# Altium schematic sheet Sheet1.SchDoc
size A4
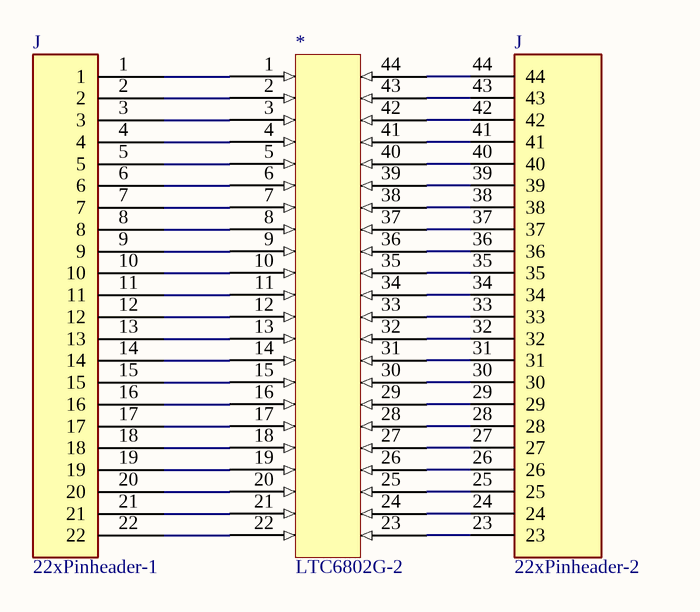
[diagram p0: Sheet1.SchDoc]

## Parts
(Parts that share a designator on the sheet are numbered #1, #2 ... from top to bottom, then left to right.)
*  LTC6802G-2  [LTC6802]
J#1  22xPinheader-1  [22XHEADER1]
J#2  22xPinheader-2  [22xHEADER-2]

## Nets
Net*_1: *.1 J#1.1
Net*_2: *.2 J#1.2
Net*_3: *.3 J#1.3
Net*_4: *.4 J#1.4
Net*_5: *.5 J#1.5
Net*_6: *.6 J#1.6
Net*_7: *.7 J#1.7
Net*_8: *.8 J#1.8
Net*_9: *.9 J#1.9
Net*_10: *.10 J#1.10
Net*_11: *.11 J#1.11
Net*_12: *.12 J#1.12
Net*_13: *.13 J#1.13
Net*_14: *.14 J#1.14
Net*_15: *.15 J#1.15
Net*_16: *.16 J#1.16
Net*_17: *.17 J#1.17
Net*_18: *.18 J#1.18
Net*_19: *.19 J#1.19
Net*_20: *.20 J#1.20
Net*_21: *.21 J#1.21
Net*_22: *.22 J#1.22
Net*_23: *.23 J#2.23
Net*_24: *.24 J#2.24
Net*_25: *.25 J#2.25
Net*_26: *.26 J#2.26
Net*_27: *.27 J#2.27
Net*_28: *.28 J#2.28
Net*_29: *.29 J#2.29
Net*_30: *.30 J#2.30
Net*_31: *.31 J#2.31
Net*_32: *.32 J#2.32
Net*_33: *.33 J#2.33
Net*_34: *.34 J#2.34
Net*_35: *.35 J#2.35
Net*_36: *.36 J#2.36
Net*_37: *.37 J#2.37
Net*_38: *.38 J#2.38
Net*_39: *.39 J#2.39
Net*_40: *.40 J#2.40
Net*_41: *.41 J#2.41
Net*_42: *.42 J#2.42
Net*_43: *.43 J#2.43
Net*_44: *.44 J#2.44

## Library data of the parts
J#1 = 22xPinheader-1: Pin header; pin strips; male; PIN: 50; straight; 2.54mm; THT; 1x50; MF: TE Connectivity; MP: 5-825433-0; Package: None; Value: *; TE_purchase_URL: https://www.te.com/usa-en/product-5-825433-0.html?te_bu=Cor&te_type=disp&te_campaign=seda_glo_cor-seda-global-disp-prtnr-fy19-seda-model-bom-cta_sma-317_1&elqCampaignId=32493; Price: None; SnapEDA_Link: https://www.snapeda.com/parts/5-825433-0/TE%20Connectivity%20AMP%20Connectors/view-part/499889/?ref=snap; Availability: Unavailable; EU_RoHS_Compliance: Compliant
J#2 = 22xPinheader-2: Pin header; pin strips; male; PIN: 50; straight; 2.54mm; THT; 1x50; MF: TE Connectivity; MP: 5-825433-0; Package: None; Value: *; TE_purchase_URL: https://www.te.com/usa-en/product-5-825433-0.html?te_bu=Cor&te_type=disp&te_campaign=seda_glo_cor-seda-global-disp-prtnr-fy19-seda-model-bom-cta_sma-317_1&elqCampaignId=32493; Price: None; SnapEDA_Link: https://www.snapeda.com/parts/5-825433-0/TE%20Connectivity%20AMP%20Connectors/view-part/499889/?ref=snap; Availability: Unavailable; EU_RoHS_Compliance: Compliant